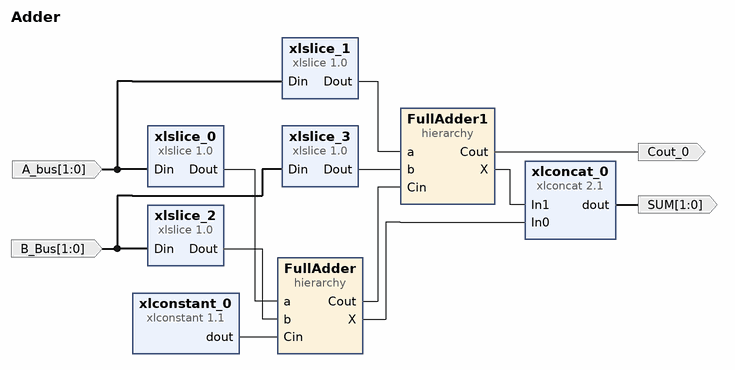
[diagram p0: block diagram of the top level]
# Vivado block design Adder, xc7a35tcpg236-1, Vivado 2018.3
create_bd_design Adder

create_bd_port -dir O Cout_0
create_bd_port -dir O -from 1 -to 0 -type data SUM
create_bd_port -dir I -from 1 -to 0 -type data A_bus
create_bd_port -dir I -from 1 -to 0 -type data B_Bus

create_bd_cell -type hier FullAdder
create_bd_cell -type hier FullAdder1
create_bd_cell -type ip -vlnv xilinx.com:ip:xlconstant:1.1 xlconstant_0
set_property -dict {CONFIG.CONST_VAL 0} [get_bd_cells xlconstant_0]
create_bd_cell -type ip -vlnv xilinx.com:ip:xlconcat:2.1 xlconcat_0
create_bd_cell -type ip -vlnv xilinx.com:ip:xlslice:1.0 xlslice_0
set_property -dict {CONFIG.DIN_FROM 0 CONFIG.DIN_TO 0 CONFIG.DIN_WIDTH 2} [get_bd_cells xlslice_0]
create_bd_cell -type ip -vlnv xilinx.com:ip:xlslice:1.0 xlslice_1
set_property -dict {CONFIG.DIN_FROM 1 CONFIG.DIN_TO 1 CONFIG.DIN_WIDTH 2 CONFIG.DOUT_WIDTH 1} [get_bd_cells xlslice_1]
create_bd_cell -type ip -vlnv xilinx.com:ip:xlslice:1.0 xlslice_2
set_property -dict {CONFIG.DIN_FROM 0 CONFIG.DIN_TO 0 CONFIG.DIN_WIDTH 2} [get_bd_cells xlslice_2]
create_bd_cell -type ip -vlnv xilinx.com:ip:xlslice:1.0 xlslice_3
set_property -dict {CONFIG.DIN_FROM 1 CONFIG.DIN_TO 1 CONFIG.DIN_WIDTH 2} [get_bd_cells xlslice_3]

# ---- hierarchy /FullAdder ----
current_bd_instance /FullAdder
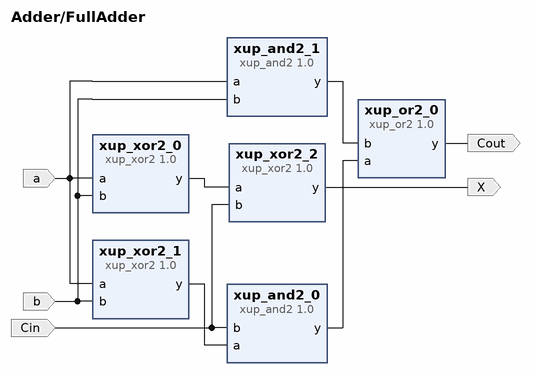
[diagram p1: block diagram inside /FullAdder]
create_bd_pin -dir I a
create_bd_pin -dir I b
create_bd_pin -dir I Cin
create_bd_pin -dir O X
create_bd_pin -dir O Cout

create_bd_cell -type ip -vlnv xilinx.com:xup:xup_xor2:1.0 xup_xor2_1
set_property -dict {CONFIG.DELAY 0} [get_bd_cells xup_xor2_1]
create_bd_cell -type ip -vlnv xilinx.com:xup:xup_and2:1.0 xup_and2_0
set_property -dict {CONFIG.DELAY 0} [get_bd_cells xup_and2_0]
create_bd_cell -type ip -vlnv xilinx.com:xup:xup_xor2:1.0 xup_xor2_0
set_property -dict {CONFIG.DELAY 0} [get_bd_cells xup_xor2_0]
create_bd_cell -type ip -vlnv xilinx.com:xup:xup_and2:1.0 xup_and2_1
set_property -dict {CONFIG.DELAY 0} [get_bd_cells xup_and2_1]
create_bd_cell -type ip -vlnv xilinx.com:xup:xup_xor2:1.0 xup_xor2_2
set_property -dict {CONFIG.DELAY 0} [get_bd_cells xup_xor2_2]
create_bd_cell -type ip -vlnv xilinx.com:xup:xup_or2:1.0 xup_or2_0
set_property -dict {CONFIG.DELAY 0} [get_bd_cells xup_or2_0]

# ---- hierarchy /FullAdder1 ----
current_bd_instance /FullAdder1
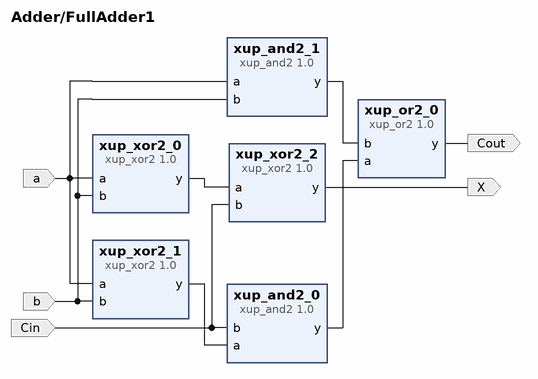
[diagram p2: block diagram inside /FullAdder1]
create_bd_pin -dir I a
create_bd_pin -dir I b
create_bd_pin -dir I Cin
create_bd_pin -dir O X
create_bd_pin -dir O Cout

create_bd_cell -type ip -vlnv xilinx.com:xup:xup_xor2:1.0 xup_xor2_1
set_property -dict {CONFIG.DELAY 0} [get_bd_cells xup_xor2_1]
create_bd_cell -type ip -vlnv xilinx.com:xup:xup_and2:1.0 xup_and2_0
set_property -dict {CONFIG.DELAY 0} [get_bd_cells xup_and2_0]
create_bd_cell -type ip -vlnv xilinx.com:xup:xup_xor2:1.0 xup_xor2_0
set_property -dict {CONFIG.DELAY 0} [get_bd_cells xup_xor2_0]
create_bd_cell -type ip -vlnv xilinx.com:xup:xup_and2:1.0 xup_and2_1
set_property -dict {CONFIG.DELAY 0} [get_bd_cells xup_and2_1]
create_bd_cell -type ip -vlnv xilinx.com:xup:xup_xor2:1.0 xup_xor2_2
set_property -dict {CONFIG.DELAY 0} [get_bd_cells xup_xor2_2]
create_bd_cell -type ip -vlnv xilinx.com:xup:xup_or2:1.0 xup_or2_0
set_property -dict {CONFIG.DELAY 0} [get_bd_cells xup_or2_0]

# ---- connections ----

current_bd_instance /FullAdder
connect_bd_net [get_bd_pins xup_xor2_1/y] [get_bd_pins xup_and2_0/a]
connect_bd_net [get_bd_pins xup_and2_0/y] [get_bd_pins xup_or2_0/a]
connect_bd_net [get_bd_pins xup_xor2_0/y] [get_bd_pins xup_xor2_2/a]
connect_bd_net [get_bd_pins xup_and2_1/y] [get_bd_pins xup_or2_0/b]
connect_bd_net -net a_0_1 [get_bd_pins a] [get_bd_pins xup_xor2_0/a] [get_bd_pins xup_and2_1/a] [get_bd_pins xup_xor2_1/a]
connect_bd_net -net b_0_1 [get_bd_pins b] [get_bd_pins xup_xor2_0/b] [get_bd_pins xup_and2_1/b] [get_bd_pins xup_xor2_1/b]
connect_bd_net -net a_1_1 [get_bd_pins Cin] [get_bd_pins xup_xor2_2/b] [get_bd_pins xup_and2_0/b]
connect_bd_net [get_bd_pins xup_xor2_2/y] [get_bd_pins X]
connect_bd_net [get_bd_pins xup_or2_0/y] [get_bd_pins Cout]

current_bd_instance /FullAdder1
connect_bd_net [get_bd_pins xup_xor2_1/y] [get_bd_pins xup_and2_0/a]
connect_bd_net [get_bd_pins xup_and2_0/y] [get_bd_pins xup_or2_0/a]
connect_bd_net [get_bd_pins xup_xor2_0/y] [get_bd_pins xup_xor2_2/a]
connect_bd_net [get_bd_pins xup_and2_1/y] [get_bd_pins xup_or2_0/b]
connect_bd_net -net a_0_1 [get_bd_pins a] [get_bd_pins xup_xor2_0/a] [get_bd_pins xup_and2_1/a] [get_bd_pins xup_xor2_1/a]
connect_bd_net -net b_0_1 [get_bd_pins b] [get_bd_pins xup_xor2_0/b] [get_bd_pins xup_and2_1/b] [get_bd_pins xup_xor2_1/b]
connect_bd_net -net a_1_1 [get_bd_pins Cin] [get_bd_pins xup_xor2_2/b] [get_bd_pins xup_and2_0/b]
connect_bd_net [get_bd_pins xup_xor2_2/y] [get_bd_pins X]
connect_bd_net [get_bd_pins xup_or2_0/y] [get_bd_pins Cout]

current_bd_instance /
connect_bd_net [get_bd_pins FullAdder/Cout] [get_bd_pins FullAdder1/Cin]
connect_bd_net [get_bd_pins FullAdder1/Cout] [get_bd_ports Cout_0]
connect_bd_net [get_bd_pins xlconstant_0/dout] [get_bd_pins FullAdder/Cin]
connect_bd_net [get_bd_pins FullAdder/X] [get_bd_pins xlconcat_0/In0]
connect_bd_net [get_bd_pins FullAdder1/X] [get_bd_pins xlconcat_0/In1]
connect_bd_net [get_bd_pins xlconcat_0/dout] [get_bd_ports SUM]
connect_bd_net [get_bd_pins xlslice_0/Dout] [get_bd_pins FullAdder/a]
connect_bd_net [get_bd_pins xlslice_1/Dout] [get_bd_pins FullAdder1/a]
connect_bd_net [get_bd_pins xlslice_3/Dout] [get_bd_pins FullAdder1/b]
connect_bd_net [get_bd_pins xlslice_2/Dout] [get_bd_pins FullAdder/b]
connect_bd_net [get_bd_ports A_bus] [get_bd_pins xlslice_0/Din] [get_bd_pins xlslice_1/Din]
connect_bd_net [get_bd_ports B_Bus] [get_bd_pins xlslice_2/Din] [get_bd_pins xlslice_3/Din]

validate_bd_design
save_bd_design
